# Altium schematic sheet sttslife_2022-01-20.schdoc
size 272 x 183 mm
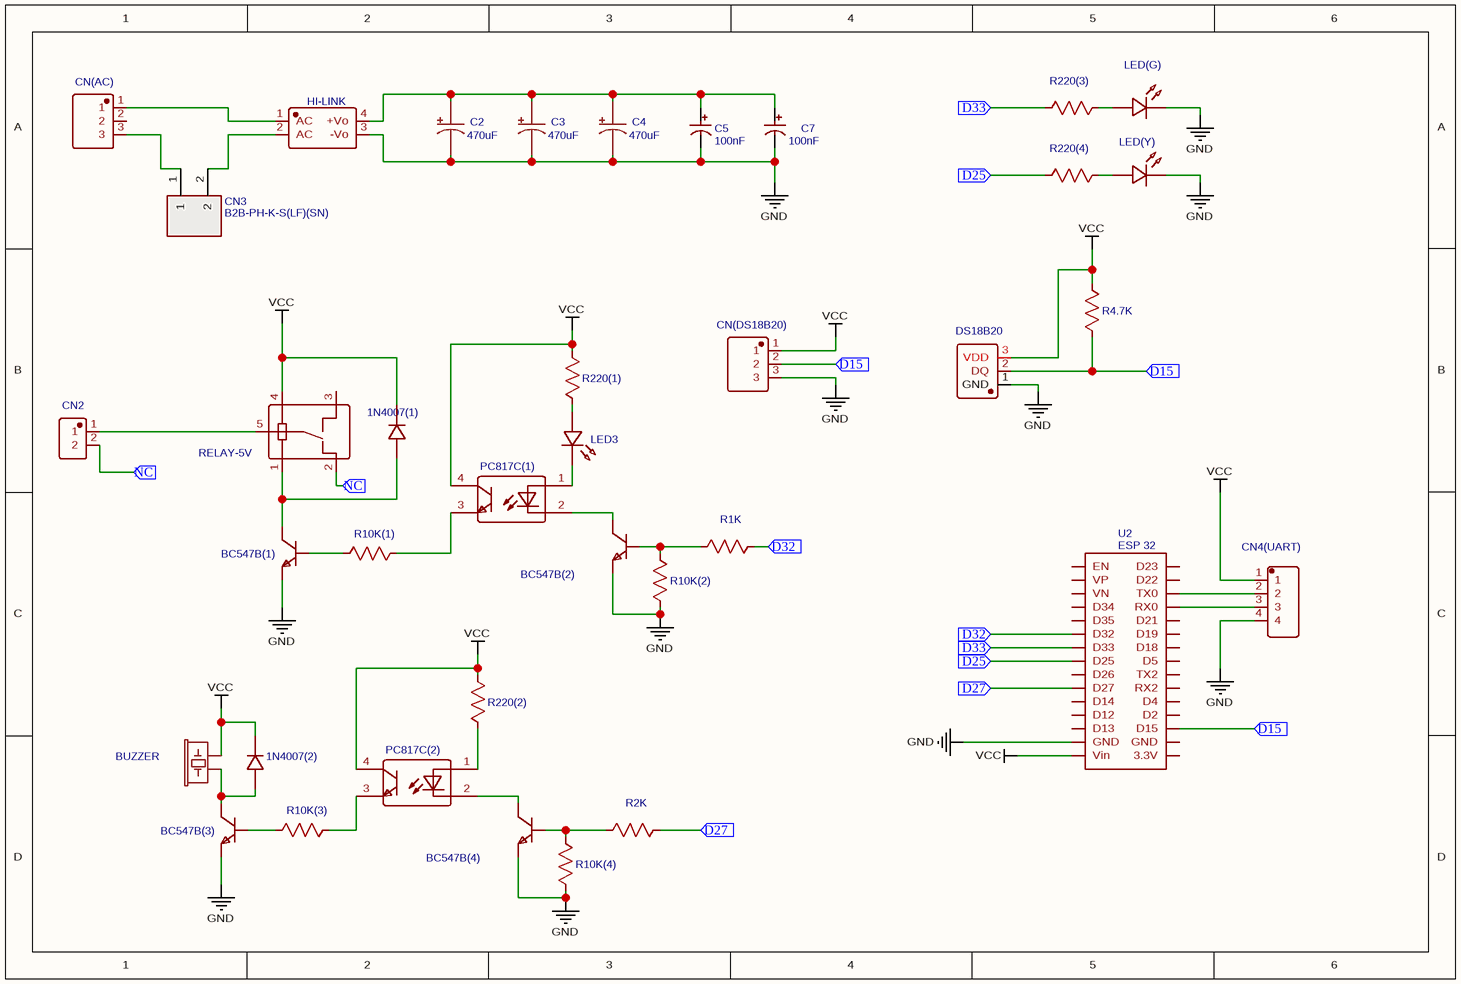
[diagram p0: sttslife_2022-01-20.schdoc]

## Parts
1N4007(1)  1N4007  [DO-41_BD2.4-L4.7-P8.70-D0.9-RD]  (value not drawn)
1N4007(2)  1N4007  [DO-41_BD2.4-L4.7-P8.70-D0.9-RD]  (value not drawn)
BC547B(1)  BC547B  [TO-92-3_L4.9-W3.7-P1.27-L]  (value not drawn)
BC547B(2)  BC547B  [TO-92-3_L4.9-W3.7-P1.27-L]  (value not drawn)
BC547B(3)  BC547B  [TO-92-3_L4.9-W3.7-P1.27-L]  (value not drawn)
BC547B(4)  BC547B  [TO-92-3_L4.9-W3.7-P1.27-L]  (value not drawn)
BUZZER  BUZZER  [BUZZER-12MM-KIT]  (value not drawn)
C2  470uF  [CAP-TH_BD10.0-P5.00-D1.0-FD]
C3  470uF  [CAP-TH_BD10.0-P5.00-D1.0-FD]
C4  470uF  [CAP-TH_BD10.0-P5.00-D1.0-FD]
C5  100nF  [CAP-TH_BD4.0-P1.50-D0.8-FD]
C7  100nF  [CAP-TH_BD4.0-P1.50-D0.8-FD]
CN2  X2581WR-02-N0SN  [CONN-TH_X2581WR-02-N0SN]  (value not drawn)
CN3  B2B-PH-K-S(LF)(SN)  [CONN-TH_B2B-PH-K-S]
CN4(UART)  PH-4AW  [CONN-TH_4P-P2.00_PH--4AW]  (value not drawn)
CN(AC)  A2501WR-3P  [CONN-TH_A2501WR-3P]  (value not drawn)
CN(DS18B20)  A2501WR-3P  [CONN-TH_A2501WR-3P]  (value not drawn)
DS18B20  DS18B20  [TO-92-3_L4.9-W3.7-P1.27-L]  (value not drawn)
HI-LINK  HI-LINK  [PWRM-TH_HLK-20MXX]  (value not drawn)
LED3  LED-TH-3mm_R  [LED-TH_BD3.0_RED]  (value not drawn)
LED(G)  LED-TH-3mm_G  [LED-TH_BD3.0_GREEN]  (value not drawn)
LED(Y)  LED-TH-3mm_B  [LED-TH_BD3.0_BLUE]  (value not drawn)
PC817C(1)  PC817C(1)  [DIP-4_L4.6-W6.5-P2.54-LS7.6-BL]  (value not drawn)
PC817C(2)  PC817C(1)  [DIP-4_L4.6-W6.5-P2.54-LS7.6-BL]  (value not drawn)
R1K  1k  [R_AXIAL-0.3]  (value not drawn)
R2K  1k  [R_AXIAL-0.3]  (value not drawn)
R4.7K  1k  [R_AXIAL-0.3]  (value not drawn)
R10K(1)  1k  [R_AXIAL-0.3]  (value not drawn)
R10K(2)  1k  [R_AXIAL-0.3]  (value not drawn)
R10K(3)  1k  [R_AXIAL-0.3]  (value not drawn)
R10K(4)  1k  [R_AXIAL-0.3]  (value not drawn)
R220(1)  1k  [R_AXIAL-0.3]  (value not drawn)
R220(2)  1k  [R_AXIAL-0.3]  (value not drawn)
R220(3)  1k  [R_AXIAL-0.3]  (value not drawn)
R220(4)  1k  [R_AXIAL-0.3]  (value not drawn)
RELAY-5V  SRD-S-105D  [RELAY-TH_SRD-S-1XXXXX]  (value not drawn)
U2  ESP 32  [ESP 32 DEVELOP KIT]

## Ports
D15 (in), D25 (in), D27 (in), D32 (in), D33 (in), NC (in)

## Nets
GND: BC547B(1).3(E) BC547B(2).3(E) BC547B(3).3(E) BC547B(4).3(E) C2.2 C3.2 C4.2 C5.2 C7.2 CN4(UART).4 CN(DS18B20).3 DS18B20.1(GND) HI-LINK.3(-Vo) LED(G).2 LED(Y).2 R10K(2).2 R10K(4).2 U2.14(GND)
VCC: 1N4007(1).1 1N4007(2).1 BUZZER.- CN4(UART).1 CN(DS18B20).1 DS18B20.3(VDD) PC817C(1).4(COL) PC817C(2).4(COL) R4.7K.2 R220(1).1 R220(2).1 RELAY-5V.4 U2.15(Vin)
D15: CN(DS18B20).2 DS18B20.2(DQ) R4.7K.1 U2.18(D15) ; port D15
D25: R220(4).2 U2.8(D25) ; port D25
D27: R2K.2 U2.10(D27) ; port D27
D32: R1K.2 U2.6(D32) ; port D32
D33: R220(3).2 U2.7(D33) ; port D33
NC: CN2.2 RELAY-5V.2 ; port NC
Net1N4007(1)_2: 1N4007(1).2 BC547B(1).1(C) RELAY-5V.1
Net1N4007(2)_2: 1N4007(2).2 BC547B(3).1(C) BUZZER.+
NetBC547B(1)_2: BC547B(1).2(B) R10K(1).1
NetBC547B(2)_1: BC547B(2).1(C) PC817C(1).2(CAT)
NetBC547B(2)_2: BC547B(2).2(B) R1K.1 R10K(2).1
NetBC547B(3)_2: BC547B(3).2(B) R10K(3).1
NetBC547B(4)_1: BC547B(4).1(C) PC817C(2).2(CAT)
NetBC547B(4)_2: BC547B(4).2(B) R2K.1 R10K(4).1
NetC2_1: C2.1 C3.1 C4.1 C5.1 C7.1 HI-LINK.4(+Vo)
NetCN2_1: CN2.1 RELAY-5V.5
NetCN3_1: CN3.1 CN(AC).3
NetCN3_2: CN3.2 HI-LINK.2(AC)
NetCN4(UART)_2: CN4(UART).2 U2.28(TX0)
NetCN4(UART)_3: CN4(UART).3 U2.27(RX0)
NetCN(AC)_1: CN(AC).1 HI-LINK.1(AC)
NetLED3_1: LED3.1 R220(1).2
NetLED3_2: LED3.2 PC817C(1).1(AN)
NetLED(G)_1: LED(G).1 R220(3).1
NetLED(Y)_1: LED(Y).1 R220(4).1
NetPC817C(1)_3: PC817C(1).3(EM) R10K(1).2
NetPC817C(2)_1: PC817C(2).1(AN) R220(2).2
NetPC817C(2)_3: PC817C(2).3(EM) R10K(3).2

Not connected (* = marked no-connect by the designer): CN(AC) 2; RELAY-5V 3; U2 1(EN) 2(VP) 3(VN) 4(D34) 5(D35) 9(D26) 11(D14) 12(D12) 13(D13) 16(3.3V) 17(GND) 19(D2) 20(D4) 21(RX2) 22(TX2) 23(D5) 24(D18) 25(D19) 26(D21) 29(D22) 30(D23)

## Library data of the parts
1N4007(1) 1N4007(2) = 1N4007: BOM_Manufacturer: (DIOTEC); Contributor: LCSC; BOM_Supplier: LCSC; BOM_Supplier Part: C212822; BOM_Manufacturer Part: 1N4007; BOM_JLCPCB Part Class: Extended Part; spicePre: D; spiceSymbolName: 1N4007_C212822
BC547B(1) BC547B(2) BC547B(3) BC547B(4) = BC547B: BOM_Manufacturer: LGE; Contributor: LCSC; BOM_Supplier: LCSC; BOM_Supplier Part: C713613; BOM_Manufacturer Part: BC547B; BOM_JLCPCB Part Class: Extended Part; spicePre: Q; spiceSymbolName: BC547B
BUZZER = BUZZER: Contributor: SparkFun; spicePre: S; spiceSymbolName: BUZZER
C2-C4 = 470uF: BOM_Manufacturer: Nichicon; BOM_Manufacturer Part: UKW1E471MPD; nameAlias: Capacitance; Contributor: LCSC; BOM_Supplier: LCSC; BOM_Supplier Part: C250976; BOM_JLCPCB Part Class: Extended Part; spicePre: C; spiceSymbolName: UKW1E471MPD
C5 C7 = 100nF: BOM_Manufacturer: ValuePro; BOM_Manufacturer Part: 0.1uF 50V 4*7; nameAlias: Capacitance; BOM_Supplier: LCSC; BOM_Supplier Part: C45664; BOM_JLCPCB Part Class: Extended Part; spicePre: C; spiceSymbolName: 0.1uF 50V 4*7
CN2 = X2581WR-02-N0SN: BOM_Manufacturer: XKB Connectivity(中国星坤); Contributor: LCSC; BOM_Supplier: LCSC; BOM_Supplier Part: C725750; BOM_Manufacturer Part: X2581WR-02-N0SN; BOM_JLCPCB Part Class: Extended Part; spicePre: C; spiceSymbolName: X2581WR-02-N0SN
CN3 = B2B-PH-K-S(LF)(SN): BOM_Manufacturer: JST; Contributor: LCSC; BOM_Supplier: LCSC; BOM_Manufacturer Part: B2B-PH-K-S(LF)(SN); BOM_Supplier Part: C131337; BOM_JLCPCB Part Class: Extended Part; spicePre: C; spiceSymbolName: B2B-PH-K-S(LF)(SN)
CN4(UART) = PH-4AW: BOM_Manufacturer: BOOMELE; spicePre: X; BOM_Supplier: LCSC; BOM_Manufacturer Part: PH-4AW; BOM_Supplier Part: C10401; BOM_JLCPCB Part Class: Extended Part; spiceSymbolName: PH-4AW
CN(AC) CN(DS18B20) = A2501WR-3P: BOM_Manufacturer: Changjiang Connectors; Contributor: LCSC; BOM_Supplier: LCSC; BOM_Supplier Part: C225400; BOM_Manufacturer Part: A2501WR-3P; BOM_JLCPCB Part Class: Extended Part; spicePre: C; spiceSymbolName: A2501WR-3P
DS18B20 = DS18B20: BOM_Manufacturer: Youtai Semiconductor Co., Ltd.; Contributor: LCSC; BOM_Supplier: LCSC; BOM_Supplier Part: C376006; BOM_Manufacturer Part: DS18B20; BOM_JLCPCB Part Class: Extended Part; spicePre: U; spiceSymbolName: DS18B20
HI-LINK = HI-LINK: BOM_Manufacturer Part: HLK-20M24; Contributor: LCSC; BOM_Supplier: LCSC; BOM_Supplier Part: C465409; BOM_Manufacturer: HI-LINK; BOM_JLCPCB Part Class: Extended Part; spicePre: U; spiceSymbolName: HLK-20M24
LED3 = LED-TH-3mm_R: BOM_Manufacturer: EVERLIGHT(台湾亿光); BOM_Manufacturer Part: 204-10SDRD/S530-A3-L; Contributor: LCEDA_Lib; BOM_Supplier Part: C84774; BOM_Supplier: LCSC; spicePre: L; spiceSymbolName: LED-TH-3mm_R
LED(G) = LED-TH-3mm_G: BOM_Manufacturer: EVERLIGHT(台湾亿光); BOM_Manufacturer Part: 204-10SYGD/S530-E3; Contributor: LCEDA_Lib; BOM_Supplier Part: C85161; spicePre: L; spiceSymbolName: LED-TH-3mm_G
LED(Y) = LED-TH-3mm_B: BOM_Manufacturer: EVERLIGHT(台湾亿光); BOM_Manufacturer Part: 204-10SUBC/S400-A4; Contributor: LCEDA_Lib; BOM_Supplier Part: C86881; BOM_Supplier: LCSC; spicePre: L; spiceSymbolName: LED-TH-3mm_B
PC817C(1) PC817C(2) = PC817C(1): BOM_Manufacturer: Wuxi China Resources Huajing Microelectronics; Contributor: LCSC; BOM_Supplier: LCSC; BOM_Supplier Part: C115500; BOM_Manufacturer Part: PC817C; BOM_JLCPCB Part Class: Extended Part; spicePre: U; spiceSymbolName: PC817C
R1K R2K R4.7K R10K(1) R10K(2) R10K(3) R10K(4) R220(1) R220(2) R220(3) R220(4) = 1k: nameAlias: Value(Ω); Contributor: LCEDA_Lib; spicePre: R; spiceSymbolName: R_AXIAL-0.3_US
RELAY-5V = SRD-S-105D: BOM_Manufacturer: SANYOU RELAYS; Contributor: LCSC; SMT Type: Extend; BOM_Supplier: LCSC; BOM_Supplier Part: C276432; BOM_Manufacturer Part: SRD-S-105D; BOM_LCSC Assembly: Yes; spicePre: K; spiceSymbolName: SRD-S-105D
U2 = ESP 32: Contributor: parinya1051; spicePre: U; spiceSymbolName: ESP 32 Develop kit